# EAGLE design opencmxx (EAGLE 6.4)
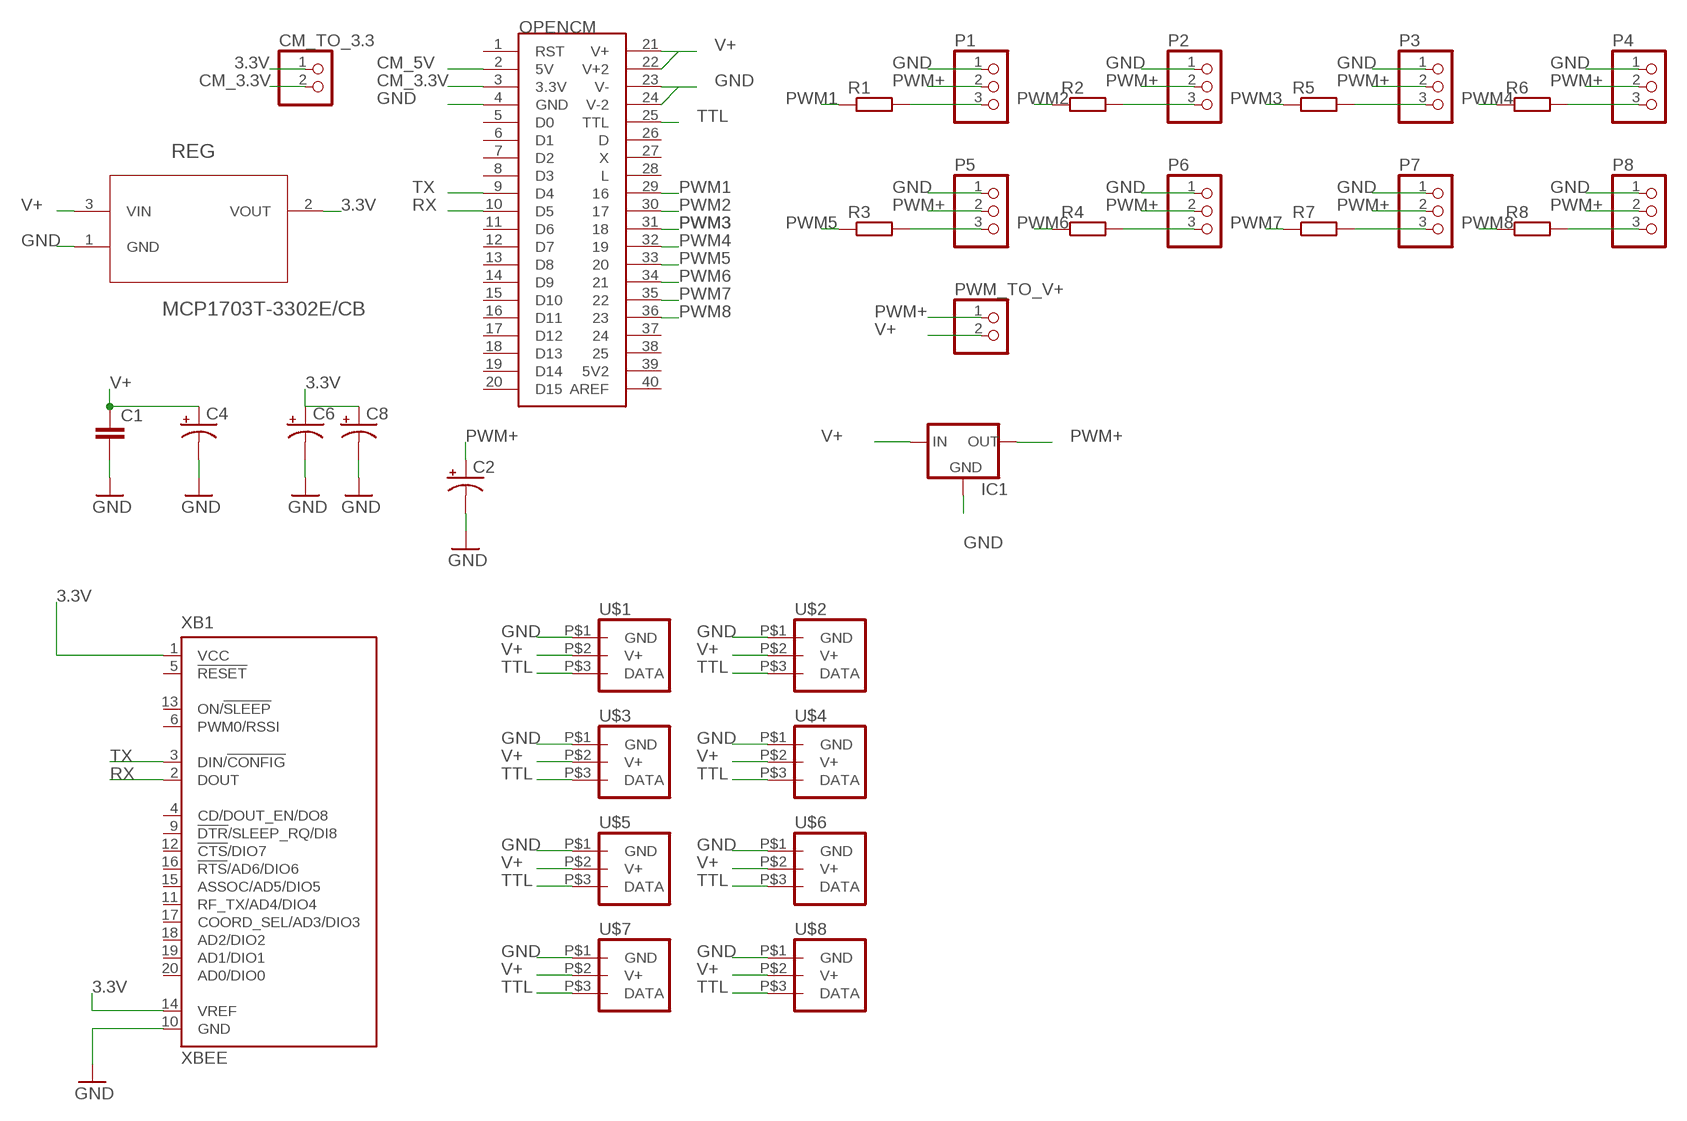
[diagram p0: schematic, sheet 1]

## Parts
C1  C-EU075-032X103  [C075-032X103]
C2  CAP_POLPTH2  [CPOL-RADIAL-10UF-25V]
C4  CAP_POLPTH2  [CPOL-RADIAL-10UF-25V]
C6  CAP_POLPTH2  [CPOL-RADIAL-10UF-25V]
C8  CAP_POLPTH2  [CPOL-RADIAL-10UF-25V]
CM_TO_3.3  CONNEC_1X02  [CONNEC_1X02]
IC1  V_REG_78XXSIDE  [78XXL]
OPENCM  OPENCM  [OPENCM]
P1  CONNEC_1X03  [CONNEC_1X03]
P2  CONNEC_1X03  [CONNEC_1X03]
P3  CONNEC_1X03  [CONNEC_1X03]
P4  CONNEC_1X03  [CONNEC_1X03]
P5  CONNEC_1X03  [CONNEC_1X03]
P6  CONNEC_1X03  [CONNEC_1X03]
P7  CONNEC_1X03  [CONNEC_1X03]
P8  CONNEC_1X03  [CONNEC_1X03]
PWM_TO_V+  CONNEC_1X02  [CONNEC_1X02]
R1  RESISTANCE-R0805  [R0805]
R2  RESISTANCE-R0805  [R0805]
R3  RESISTANCE-R0805  [R0805]
R4  RESISTANCE-R0805  [R0805]
R5  RESISTANCE-R0805  [R0805]
R6  RESISTANCE-R0805  [R0805]
R7  RESISTANCE-R0805  [R0805]
R8  RESISTANCE-R0805  [R0805]
REG  MCP1703T-3302E/CB  [SOT95P300X145-3N]
U$1  XL_320_CONNEC  [DXL_320_CONNEC]
U$2  XL_320_CONNEC  [DXL_320_CONNEC]
U$3  XL_320_CONNEC  [DXL_320_CONNEC]
U$4  XL_320_CONNEC  [DXL_320_CONNEC]
U$5  XL_320_CONNEC  [DXL_320_CONNEC]
U$6  XL_320_CONNEC  [DXL_320_CONNEC]
U$7  XL_320_CONNEC  [DXL_320_CONNEC]
U$8  XL_320_CONNEC  [DXL_320_CONNEC]
XB1  XBEE  [XBEE]

## Nets
3.3V: C6.1(+) C8.1(+) CM_TO_3.3.1 REG.2(VOUT) XB1.1(VCC) XB1.14(VREF)
CM_3.3V: CM_TO_3.3.2 OPENCM.3(3.3V)
CM_5V: OPENCM.2(5V)
GND [alime]: C1.2 C2.2(-) C4.2(-) C6.2(-) C8.2(-) IC1.GND OPENCM.4(GND) OPENCM.23(V-) OPENCM.24(V-2) P1.1 P2.1 P3.1 P4.1 P5.1 P6.1 P7.1 P8.1 REG.1(GND) U$1.P$1(GND) U$2.P$1(GND) U$3.P$1(GND) U$4.P$1(GND) U$5.P$1(GND) U$6.P$1(GND) U$7.P$1(GND) U$8.P$1(GND) XB1.10(GND)
N$2: P2.3 R2.2
N$3: P1.3 R1.2
N$5: P5.3 R3.2
N$7: P6.3 R4.2
N$9: P3.3 R5.2
N$11: P4.3 R6.2
N$13: P7.3 R7.2
N$15: P8.3 R8.2
PWM1: OPENCM.29 R1.1
PWM2: OPENCM.30 R2.1
PWM3: OPENCM.31 R5.1
PWM4: OPENCM.32 R6.1
PWM5: OPENCM.33 R3.1
PWM6: OPENCM.34 R4.1
PWM7: OPENCM.35 R7.1
PWM8: OPENCM.36 R8.1
PWM+ [alime]: C2.1(+) IC1.OUT P1.2 P2.2 P3.2 P4.2 P5.2 P6.2 P7.2 P8.2 PWM_TO_V+.1
RX: OPENCM.10(D5) XB1.2(DOUT)
TTL: OPENCM.25(TTL) U$1.P$3(DATA) U$2.P$3(DATA) U$3.P$3(DATA) U$4.P$3(DATA) U$5.P$3(DATA) U$6.P$3(DATA) U$7.P$3(DATA) U$8.P$3(DATA)
TX: OPENCM.9(D4) XB1.3(DIN/!CONFIG)
V+ [alime]: C1.1 C4.1(+) IC1.IN OPENCM.21(V+) OPENCM.22(V+2) PWM_TO_V+.2 REG.3(VIN) U$1.P$2(V+) U$2.P$2(V+) U$3.P$2(V+) U$4.P$2(V+) U$5.P$2(V+) U$6.P$2(V+) U$7.P$2(V+) U$8.P$2(V+)
Unconnected: OPENCM.1(RST) OPENCM.5(D0) OPENCM.6(D1) OPENCM.7(D2) OPENCM.8(D3) OPENCM.11(D6) OPENCM.12(D7) OPENCM.13(D8) OPENCM.14(D9) OPENCM.15(D10) OPENCM.16(D11) OPENCM.17(D12) OPENCM.18(D13) OPENCM.19(D14) OPENCM.20(D15) OPENCM.26(D) OPENCM.27(X) OPENCM.28(L) OPENCM.37 OPENCM.38 OPENCM.39(5V2) OPENCM.40(AREF) XB1.4(CD/DOUT_EN/DO8) XB1.5(!RESET) XB1.6(PWM0/RSSI) XB1.9(!DTR!/SLEEP_RQ/DI8) XB1.11(RF_TX/AD4/DIO4) XB1.12(!CTS!/DIO7) XB1.13(ON/!SLEEP) XB1.15(ASSOC/AD5/DIO5) XB1.16(!RTS!/AD6/DIO6) XB1.17(COORD_SEL/AD3/DIO3) XB1.18(AD2/DIO2) XB1.19(AD1/DIO1) XB1.20(AD0/DIO0)

## Library data of the parts
C1 = rcl:C-EU: CAPACITOR, European symbol
C2 C4 C6 C8 = SparkFun-Capacitors:CAP_POL: Capacitor Polarized These are standard SMD and PTH capacitors. Normally 10uF, 47uF, and 100uF in electrolytic and tantalum varieties. Always verify the external diameter of the through hole cap, it varies with capacity, voltage, and manufacturer. The EIA devices should be standard.
CM_TO_3.3 PWM_TO_V+ = RobotCampus:CONNEC_1X02
IC1 = SparkFun-PowerIC:V_REG_78XX: Voltage Regulator Standard 7805 5V regulator. IGO (Input Ground Output). Spark Fun Electronics SKU : COM-00107
OPENCM = RobotCampus:OPENCM
P1-P8 = RobotCampus:CONNEC_1X03
R1-R8 = rhoban:RESISTANCE: RESISTOR, European symbol
REG = RobotCampus:MCP1703T-3302E/CB: Low Quiescent Current LDO Regulator; MPN: MCP1703T-3302E/CB; OC_FARNELL: 1439518; OC_NEWARK: 40M0637; PACKAGE: SOT-3; SUPPLIER: Microchip
U$1-U$8 = RobotCampus:XL_320_CONNEC
XB1 = RobotCampus:XBEE: XBee (TM) /XBee-PRO(TM) OEM RF Modules Source: MaxStream, Inc. xbee_productmanual.pdf; MPN: XBP24-Z7UIT-004; OC_FARNELL: 1751799; OC_NEWARK: 34R5507

## Net classes
1 alime: width 1.016 mm

## Board
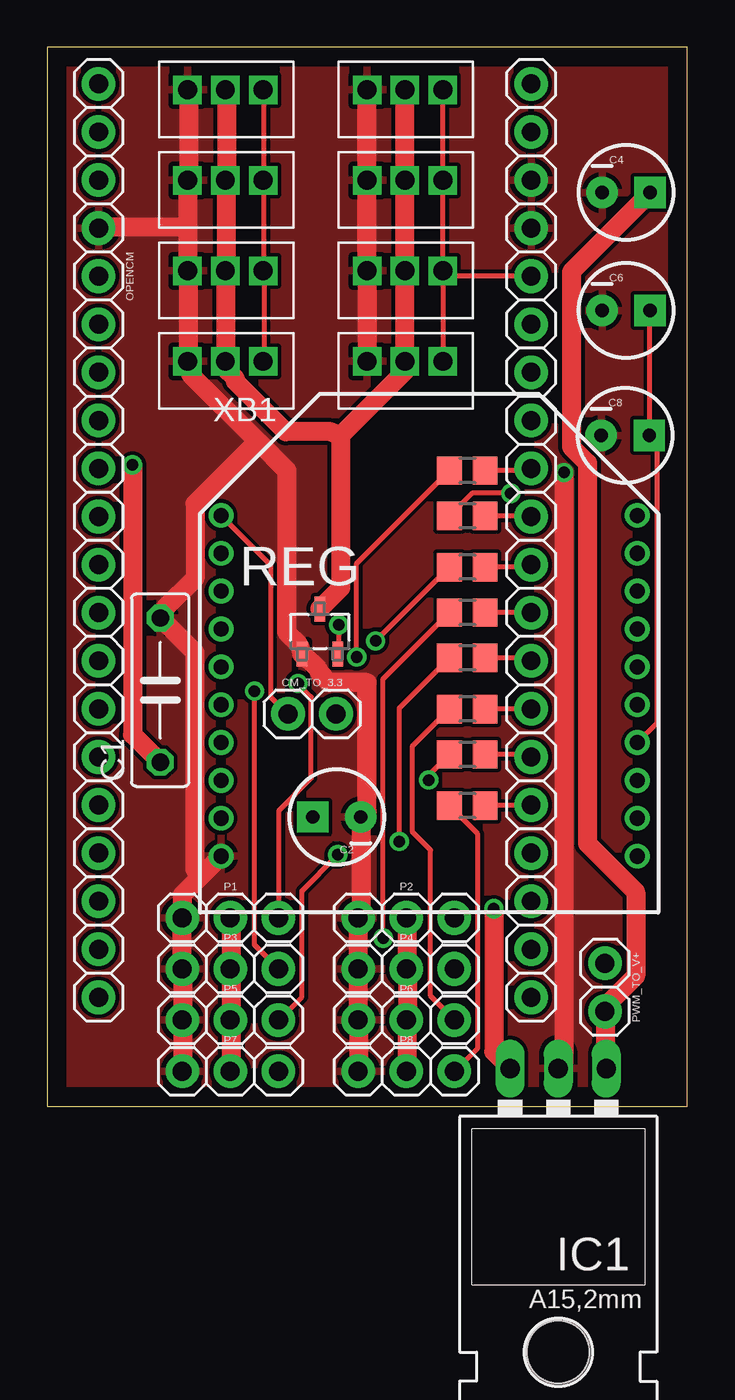
[diagram p1: board, top side]
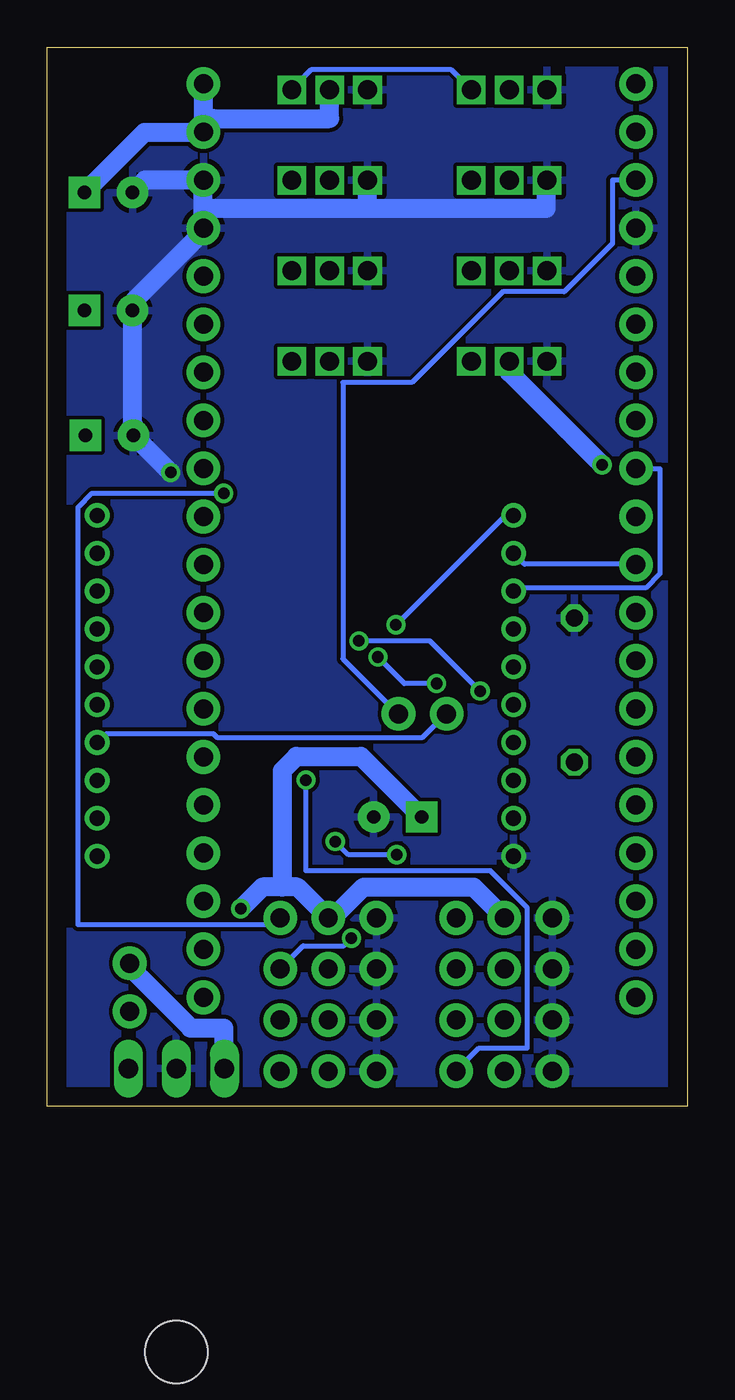
[diagram p2: board, bottom side, seen from below]

Size 33.82 x 55.96 mm. Coordinates in mm from the lower left corner, seen from the top.
Outline: 0,0 33.82,0 33.82,55.96 0,55.96 0,0
Copper layers (1*16): Top 0.035mm / dielectric 1.5mm / Bottom 0.035mm
Design rules "default": minimum track width 10mil, minimum drill 24mil, track to track 8mil, track to pad 8mil, pad to pad 8mil, via to via 8mil, smd to smd 8mil, copper to edge 40mil, drill to drill 8mil, minimum pad ring 10mil, minimum via ring 8mil, stop-mask expansion 4mil, vias tented up to drill 0mil, thermal gap 10mil

### Footprints (pad centres in the part's own frame; a part is rotated, then mirrored left to right if it is on the bottom)
C075-032X103 = drill 0.914 octagon: 1 -3.81,0; 2 3.81,0
CPOL-RADIAL-10UF-25V = drill 0.7 pad 1.651 square: 1 1.27,0 | drill 0.7 pad 1.651: 2 -1.27,0
CONNEC_1X02 = drill 1 pad 1.778: 1 -1.27,1.27; 2 1.27,1.27
78XXL = drill 1.016 long: GND 0,-3.81; IN -2.54,-3.81; OUT 2.54,-3.81 | hole 3.302: 0,11.176
OPENCM = drill 1 pad 1.778: 1 -25.4,-5.08; 2 -22.86,-5.08; 3 -20.32,-5.08; 4 -17.78,-5.08; 5 -15.24,-5.08; 6 -12.7,-5.08; 7 -10.16,-5.08; 8 -7.62,-5.08; 9 -5.08,-5.08; 10 0,-5.08; 11 -2.54,-5.08; 12 2.54,-5.08; 13 5.08,-5.08; 14 7.62,-5.08; 15 10.16,-5.08; 16 12.7,-5.08; 17 15.24,-5.08; 18 17.78,-5.08; 19 20.32,-5.08; 20 22.86,-5.08; 21 -25.4,17.78; 22 -22.86,17.78; 23 -20.32,17.78; 24 -17.78,17.78; 25 -15.24,17.78; 26 -12.7,17.78; 27 -10.16,17.78; 28 -7.62,17.78; 29 -5.08,17.78; 30 -2.54,17.78; 31 0,17.78; 32 2.54,17.78; 33 5.08,17.78; 34 7.62,17.78; 35 10.16,17.78; 36 12.7,17.78; 37 15.24,17.78; 38 17.78,17.78; 39 20.32,17.78; 40 22.86,17.78
CONNEC_1X03 = drill 1 pad 1.778: 1 -1.27,1.27; 2 1.27,1.27; 3 3.81,1.27
R0805 = smd 1.3 x 1.5: 1 -0.95,0; 2 0.95,0
SOT95P300X145-3N = smd 0.559 x 1.321: 1 -0.94,-1.194; 2 0.94,-1.194; 3 0,1.194
DXL_320_CONNEC = drill 1 square: P$1 -10,2.5; P$2 -8,2.5; P$3 -6,2.5
XBEE = drill 0.8 pad 1.27: 1 -11,9; 2 -11,7; 3 -11,5; 4 -11,3; 5 -11,1; 6 -11,-1; 7 -11,-3; 8 -11,-5; 9 -11,-7; 10 -11,-9; 11 11,-9; 12 11,-7; 13 11,-5; 14 11,-3; 15 11,-1; 16 11,1; 17 11,3; 18 11,5; 19 11,7; 20 11,9

### Placement (x,y rotation side)
C1  5.97,22 90 top
C2  15.3,15.3 180 top
C4  30.59,48.29 0 top
C6  30.59,42.06 0 top
C8  30.54,35.46 0 top
CM_TO_3.3  13.99,19.48 0 top
IC1  27,-1.8 180 top
OPENCM  7.79,28.63 270 top
P1  8.4,8.7 0 top
P2  17.7,8.7 0 top
P3  8.4,6 0 top
P4  17.7,6 0 top
P5  8.4,3.3 0 top
P6  17.7,3.3 0 top
P7  8.4,0.6 0 top
P8  17.7,0.6 0 top
PWM_TO_V+  28.2,6.3 270 top
R1  22.2,33.6 180 top
R2  22.2,31.2 180 top
R3  22.2,23.7 180 top
R4  22.2,21 180 top
R5  22.2,28.5 180 top
R6  22.2,26.1 180 top
R7  22.2,18.6 180 top
R8  22.2,15.9 180 top
REG  14.4,25.1 0 top
U$1  26.9,51.21 0 top
U$2  26.9,46.43 0 top
U$3  26.9,41.65 0 top
U$4  17.41,46.43 0 top
U$5  17.41,51.21 0 top
U$6  17.41,36.87 0 top
U$7  26.9,36.87 0 top
U$8  17.41,41.65 0 top
XB1  20.18,22.23 0 top

### Tracks (layer width: path | path; a pad name or v marks a point on that pad's centre or on a via)
3.3V  (via drill 0.61)
  Top 0.254: v15.4,25.45 15.4,24 15.35,23.95 REG.2 | CM_TO_3.3.1 12.7,20.75 11.8,21.65 11.8,28.6 9.2,31.2 XB1.1 | XB1.14 32.2,20.25 32.2,35.1 31.85,35.45 C8.1 31.85,35.55 C6.1
  Bottom 0.254: v15.4,25.45 9.65,31.2 9.2,31.2 XB1.1 | CM_TO_3.3.1 12.75,20.75 14,19.5 24.85,19.5 25.05,19.7 30.7,19.7 31.15,19.25 XB1.14
CM_3.3V
  Bottom 0.254: OPENCM.3 3.95,48.95 3.95,45.6 6.5,43.05 9.75,43.05 14.55,38.25 18.2,38.25 18.2,23.65 15.3,20.75 CM_TO_3.3.2
GND  (via drill 0.61)
  Top 1.016: P7.1 7.15,1.9 7.15,4.55 P5.1 7.15,5.05 7.15,6.8 P3.1 7.1,7.3 7.1,9.45 P1.1 7.15,10 7.15,11.2 8.15,12.2 | 8.15,12.2 XB1.10 | 8.15,12.2 7.8,12.55 7.8,24 6,25.8 C1.2 6.2,26.3 7.8,27.9 7.8,31.85 11.1,35.15 | P8.1 16.45,1.9 16.45,4.55 P6.1 16.45,5.05 16.45,7.25 P4.1 16.45,7.75 16.45,9.95 P2.1 16.6,10.45 16.6,14.8 C2.2 16.6,15.3 16.9,15.6 16.9,22.4 14.9,22.4 14.4,22.9 14.4,22.95 14.35,23 14.35,23.05 13.5,23.9 REG.1 13.3,24.4 12.65,25.05 12.65,33.6 11.1,35.15 | 7.45,46.45 7.45,44.65 U$8.P$1 7.45,44.15 7.45,39.4 U$6.P$1 7.55,38.85 7.55,38.7 11.1,35.15 | 7.45,46.45 7.45,48.9 U$4.P$1 7.5,49.45 7.5,53.65 7.45,53.7 U$5.P$1 | 7.45,46.45 2.75,46.45 OPENCM.4 | U$7.P$1 U$3.P$1 U$2.P$1 U$1.P$1 | v27.3,33.5 27.3,2.35 27,2.05 IC1.GND
  Bottom 1.016: C4.2 29.3,48.3 28.65,48.95 OPENCM.23 25.6,48.45 25.6,47.45 | 25.6,47.45 25.6,46.45 OPENCM.24 25.85,45.95 29.25,42.55 C6.2 29.3,42.05 29.3,36 29.25,36 C8.2 29.25,35.45 v27.3,33.5 | 16.9,47.45 U$2.P$1 | 25.6,47.45 16.9,47.45 | 16.9,47.45 7.45,47.45 7.45,48.9 U$4.P$1
  pour Top: -28.2,58.5 73.8,58.5 73.8,-2.4 -29.1,-2.4 -29.1,36.9
  pour Bottom: -5.7,59.7 48.9,59.7 48.9,-6.9 -15.3,-6.9 -15.3,39.6
N$2  (via drill 0.61)
  Top 0.254: R2.2 22.45,32.4 v24.5,32.4
  Bottom 0.254: v24.5,32.4 31.45,32.4 32.2,31.65 32.2,9.6 21.9,9.6 21.55,9.95 P2.3
N$3  (via drill 0.61)
  Top 0.254: R1.2 16.35,28.7 v16.35,23.75 | v13.25,22.35 13.95,21.65 13.95,17.35 12.25,15.65 12.25,10 P1.3
  Bottom 0.254: v16.35,23.75 14.95,22.35 v13.25,22.35
N$5  (via drill 0.61)
  Top 0.254: R3.2 18.6,21.05 v18.6,14 | v15.35,13.3 13.45,11.4 13.45,5.8 12.25,4.6 P5.3
  Bottom 0.254: v18.6,14 17.9,13.3 v15.35,13.3
N$7
  Top 0.254: R4.2 19.3,19.05 19.3,14.5 20.25,13.55 20.25,5.85 21.5,4.6 P6.3
N$9  (via drill 0.61)
  Top 0.254: v17.35,24.6 R5.2 | v10.95,21.95 10.95,8.55 12.2,7.3 P3.3
  Bottom 0.254: v17.35,24.6 13.6,24.6 v10.95,21.95
N$11  (via drill 0.61)
  Top 0.254: R6.2 17.75,22.6 v17.75,8.9
  Bottom 0.254: v17.75,8.9 18.15,8.5 20.3,8.5 21.5,7.3 P4.3
N$13  (via drill 0.61)
  Top 0.254: R7.2 20.15,17.5 v20.15,17.25
  Bottom 0.254: v20.15,17.25 20.15,12.45 10.4,12.45 8.45,10.5 8.45,3.1 11,3.1 12.2,1.9 P7.3
N$15
  Top 0.254: R8.2 22.75,14.4 22.75,3.1 21.55,1.9 P8.3
PWM1
  Top 0.254: R1.1 25.55,33.6 25.55,33.7 OPENCM.29
PWM2
  Top 0.254: R2.1 25.55,31.2 OPENCM.30
PWM3
  Top 0.254: R5.1 25.55,28.5 25.55,28.6 OPENCM.31
PWM4
  Top 0.254: R6.1 25.55,26.1 OPENCM.32
PWM5
  Top 0.254: R3.1 25.55,23.7 25.55,23.55 OPENCM.33
PWM6
  Top 0.254: R4.1 25.55,21 OPENCM.34
PWM7
  Top 0.254: R7.1 25.55,18.6 25.55,18.5 OPENCM.35
PWM8
  Top 0.254: R8.1 25.55,15.9 OPENCM.36
PWM+  (via drill 0.61)
  Top 1.016: P7.2 9.7,1.9 9.7,4.55 P5.2 9.75,5.1 9.75,7.2 9.7,7.25 P3.2 9.75,7.8 9.75,9.9 9.7,9.95 P1.2 | P8.2 19,1.9 19,4.55 P6.2 19.05,5.1 19.05,7.2 19,7.25 P4.2 19.05,7.8 19,7.85 19,9.95 P2.2 | v23.6,10.45 23.6,2.9 24.45,2.05 IC1.OUT
  Bottom 1.016: IC1.OUT 24.5,2.05 24.5,4.15 26.25,4.15 29.45,7.35 29.45,7.55 PWM_TO_V+.1 | 21.4,11.6 21.4,17.75 20.65,18.5 17.25,18.5 14.05,15.3 C2.1 | 21.4,11.6 20.6,11.6 P2.2 18.5,10.2 17.1,11.6 11.3,11.6 P1.2 | v23.6,10.45 22.45,11.6 21.4,11.6
RX
  Bottom 0.254: XB1.2 8.6,28.65 2.75,28.65 OPENCM.10
TTL
  Top 0.254: U$6.P$3 11.45,39.4 11.45,44.15 U$8.P$3 11.45,44.25 11.45,48.9 U$4.P$3 11.45,49.05 11.45,53.7 U$5.P$3 | U$3.P$3 U$7.P$3 | U$3.P$3 U$2.P$3 U$1.P$3 | OPENCM.25 25.55,43.9 21,43.9 U$3.P$3
  Bottom 0.254: U$5.P$3 12.5,54.8 19.85,54.8 20.9,53.75 U$1.P$3
TX
  Bottom 0.254: XB1.3 9.15,27.25 9,27.4 2.2,27.4 1.45,28.15 1.45,33.7 OPENCM.9
V+  (via drill 0.61)
  Top 1.016: U$5.P$2 9.45,53.7 9.5,53.65 9.5,49.45 U$4.P$2 9.45,48.9 9.45,44.15 U$8.P$2 9.45,43.65 9.45,39.4 U$6.P$2 9.55,38.85 9.95,38.45 9.95,38.3 12.6,35.65 15,35.65 15.5,35.45 | v4.5,33.9 4.5,19.65 5.95,18.2 C1.1 | 15.5,35.45 15.5,27.4 REG.3 | 15.5,35.45 18.9,38.85 U$7.P$2 U$3.P$2 U$2.P$2 U$1.P$2 | IC1.IN 29.5,2.05 29.5,5 PWM_TO_V+.2 29.7,5.5 31.1,6.9 31.1,11.35 28.55,13.9 28.55,34 27.7,34.85 27.7,44.1 31.85,48.25 C4.1
  Bottom 1.016: v4.5,33.9 9.4,38.8 9.4,39.35 U$6.P$2 | C4.1 28.7,51.45 25.6,51.45 OPENCM.22 | OPENCM.21 25.55,54 25.55,52 OPENCM.22 | U$1.P$2 18.9,52.2 25.05,52.2 OPENCM.22